# Altium schematic sheet Timer.SchDoc: Timer
size A4
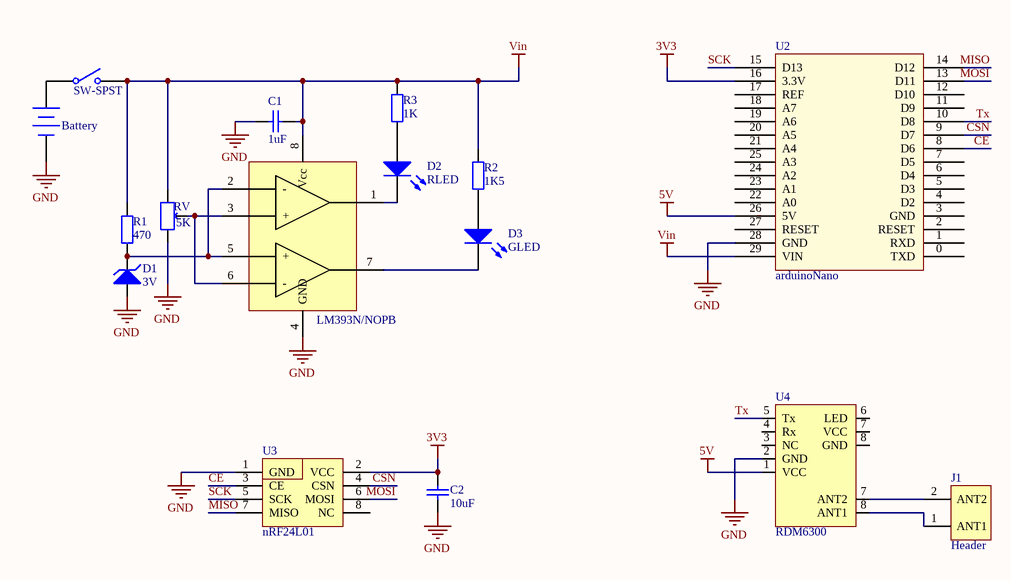
[diagram p0: Timer.SchDoc]

## Parts
BT1  Battery  [BAT-2]
C1  1uF  [RAD-0.3]
C2  10uF  [RAD-0.3]
D1  3V
D2  RLED  [LED-0]
D3  GLED  [LED-0]
J1  Header
R1  470  [AXIAL-0.4]
R2  1K5  [AXIAL-0.4]
R3  1K  [AXIAL-0.4]
RV  5K
S1  SW-SPST  [SPST-2]
U1  LM393N/NOPB
U2  arduinoNano  [Arduino nano]
U3  nRF24L01
U4  RDM6300

## Nets
3V3: C2.1 U2.16(3.3V) U3.2(VCC)
5V: U2.26(5V) U4.1(VCC)
GND: BT1.2(-) C1.2 C2.2 D1.2 RV.1 U1.4(GND) U2.28(GND) U3.1(GND) U4.2(GND)
Vin: C1.1 R1.2 R2.2 R3.2 RV.3 S1.2(NO) U1.8(Vcc) U2.29(VIN)
CE: U2.8(D6) U3.3(CE)
CSN: U2.9(D7) U3.4(CSN)
MISO: U2.14(D12) U3.7(MISO)
MOSI: U2.13(D11) U3.6(MOSI)
SCK: U2.15(D13) U3.5(SCK)
Tx: U2.10(D8) U4.5(Tx)
NetBT1_1: BT1.1(+) S1.1(COMMON)
NetD1_1: D1.1 R1.1 U1.2(-) U1.5(+)
NetD2_1: D2.1(A) R3.1
NetD2_2: D2.2(K) U1.1(Aout)
NetD3_1: D3.1(A) R2.1
NetD3_2: D3.2(K) U1.7(Bout)
NetJ1_1: J1.1(ANT1) U4.8(GND)
NetJ1_2: J1.2(ANT2) U4.7(VCC)
NetRV_2: RV.2 U1.3(+) U1.6(-)

Not connected (* = marked no-connect by the designer): U2 0(TXD) 1(RXD) 2(RESET) 3(GND) 4(D2) 5(D3) 6(D4) 7(D5) 11(D9) 12(D10) 17(REF) 18(A7) 19(A6) 20(A5) 21(A4) 22(A0) 23(A1) 24(A2) 25(A3) 27(RESET); U3 8(NC); U4 3(NC) 4(Rx) 6(LED)

## Library data of the parts
BT1 = Battery: Multicell Battery; Published: 24-Mar-1999; LatestRevisionDate: 17-Jul-2002; LatestRevisionNote: Re-released for DXP Platform.; PackageReference: BAT-2; Publisher: Altium Limited; PackageDescription: Battery; 2 Leads
C1 C2 = Cap: Capacitor; Published: 8-Jun-2000; LatestRevisionDate: 17-Jul-2002; LatestRevisionNote: Re-released for DXP Platform.; PackageReference: RAD-0.3; Publisher: Altium Limited; PackageDescription: Radial Cap, Thru-Hole; 2 Leads; 0.3 in Pin Spacing
D1 = BZX79-C3V0,113: DIODE ZENER 3V 500MW DO-35; Manufacturer: NXP Semiconductors; Voltage Tolerance: 5%; Element Configuration: Single; Max Reverse Leakage Current: 10uA; Impedance: 95R; Max Power Dissipation: 400mW; Test Current: 5mA; ESD Protection: No; Supplier 1: Farnell; Manufacturer Part Number: BZX79-C3V0,113; Stock 1: 0; Mount: Through Hole; Case/Package: DO-35; Number of Pins: 2; Contact Plating: Tin; Min Operating Temperature: -65°C; Max Operating Temperature: 200°C; Zener Voltage: 3V; Packaging: Tape and Reel; Power Dissipation: 500mW; Package Quantity: 1; Tolerance: 5%; Series: -; Length: 4.25mm; Width: 1.85mm; Height: 1.85mm; Radiation Hardening: No; RoHS Compliant: Yes; Lead Free: Lead Free; REACH SVHC: No SVHC; ComponentLink1URL: http://www.nxp.com/documents/data_sheet/BZX79.pdf?src-supplier=Digi-Key; ComponentLink1Description: http://www.nxp.com/documents/data_sheet/BZX79.pdf?src-supplier=Digi-Key; ComponentLink2URL: http://www.nxp.com/documents/data_sheet/BZX79.pdf?src-supplier=Avnet; ComponentLink2Description: http://www.nxp.com/documents/data_sheet/BZX79.pdf?src-supplier=Avnet; Supplier Part Number 1: 2377413
D2 D3 = LED0: Typical INFRARED GaAs LED; Published: 8-Jun-2000; LatestRevisionDate: 08-Jul-2005; LatestRevisionNote: Mech Layer 1 removed.; PackageReference: LED-0; Publisher: Altium Limited; PackageDescription: LED; 2 Leads
J1 = Antenna header
R1-R3 = Res2: Resistor; Published: 8-Jun-2000; LatestRevisionDate: 17-Jul-2002; LatestRevisionNote: Re-released for DXP Platform.; PackageReference: AXIAL-0.4; Publisher: Altium Limited; PackageDescription: Axial Device, Thru-Hole; 2 Leads; 0.4 in Pin Spacing
RV = Trimmer
S1 = SW-SPST: Single-Pole, Single-Throw Switch; Published: 24-Mar-1999; LatestRevisionDate: 17-Jul-2002; LatestRevisionNote: Re-released for DXP Platform.; PackageReference: SPST-2; Publisher: Altium Limited; PackageDescription: Switch; 2 Leads
U1 = LM393N/NOPB: TEXAS INSTRUMENTS - LM393N/NOPB - Analogue Comparator, Dual, Precision, 2, 1.3  s,   1V to   18V, DIP, 8 RoHS Compliant: Yes; Manufacturer: TI National Semiconductor; Voltage Gain: 106.02dB; Min Supply Voltage: 2V; Max Supply Voltage: 36V; Operating Supply Voltage: 28V; Nominal Supply Current: 1mA; Number of Elements: 2; Max Power Dissipation: 780mW; Output Current: 16mA; Dual Supply Voltage: 9V; Propagation Delay: 700ns; Max Supply Current: 200uA; Input Bias Current: 250nA; Input Offset Voltage (Vos): 5mV; Response Time: 1.3us; Quiescent Current: 2.5mA; Turn-On Delay Time: 0.4us; Output Type: TTL; Output Compatibility: CMOS; Supplier 1: Farnell; Manufacturer Part Number: LM393N/NOPB; Stock 1: 0; Pricing 1: 1=0.658, 50=0.575, 100=0.37, 250=0.336, 500=0.303, 1000=0.269, 2500=0.255, 5000=0.241 (GBP); Mount: Through Hole; Case/Package: PDIP; Number of Pins: 8; Weight: 0.01lb; Contact Plating: Tin,Matte; Min Operating Temperature: 0°C; Max Operating Temperature: 70°C; Min Dual Supply Voltage: 1V; Max Dual Supply Voltage: 18V; Packaging: Rail/Tube; Package Quantity: 40; Number of Channels: 2; Max Input Current: 250nA; Power Dissipation: 780mW; Termination: Through Hole; Type: General Purpose; Technology: BIPOLAR; Supply Current: 1mA; Length: 9.27mm; Width: 6.35mm; Height: 3.3mm; Radiation Hardening: No; REACH SVHC: No SVHC; Lead Free: Lead Free; RoHS Compliant: Yes; ComponentLink1URL: http://www.farnell.com/datasheets/1902684.pdf?src-supplier=Element14; ComponentLink1Description: http://www.farnell.com/datasheets/1902684.pdf?src-supplier=Element14; ComponentLink2URL: https://www.distrelec.biz/Web/Downloads/at/_e/oiLMx93-2903_dat_e.pdf?mime=application%2Fpdf&src-supplier=Distrelec; ComponentLink2Description: https://www.distrelec.biz/Web/Downloads/at/_e/oiLMx93-2903_dat_e.pdf?mime=application%2Fpdf&src-supplier=Distrelec; ComponentLink3URL: http://www.ti.com/general/docs/suppproductinfo.tsp?distId=10&amp;gotoUrl=http%3A%2F%2Fwww.ti.com%2Flit%2Fgpn%2Flm193-n&src-supplier=Digi-Key; ComponentLink3Description: http://www.ti.com/general/docs/suppproductinfo.tsp?distId=10&amp;gotoUrl=http%3A%2F%2Fwww.ti.com%2Flit%2Fgpn%2Flm193-n&src-supplier=Digi-Key; ComponentLink4URL: http://www.produktinfo.conrad.com/datenblaetter/1000000-1099999/001010794-da-01-en-IC_COMP_DUAL_LPWR_LM393N_NOPB_PDIP_8_TID.pdf?src-supplier=Conrad; ComponentLink4Description: http://www.produktinfo.conrad.com/datenblaetter/1000000-1099999/001010794-da-01-en-IC_COMP_DUAL_LPWR_LM393N_NOPB_PDIP_8_TID.pdf?src-supplier=Conrad; ComponentLink5URL: http://datasheet.iiic.cc/national_semiconductor/LM393N_NOPB.pdf?src-supplier=IIIC; ComponentLink5Description: http://datasheet.iiic.cc/national_semiconductor/LM393N_NOPB.pdf?src-supplier=IIIC; Supplier Part Number 1: 1468961